# EAGLE design Wireless RIFID Reader (EAGLE 6.6.0)
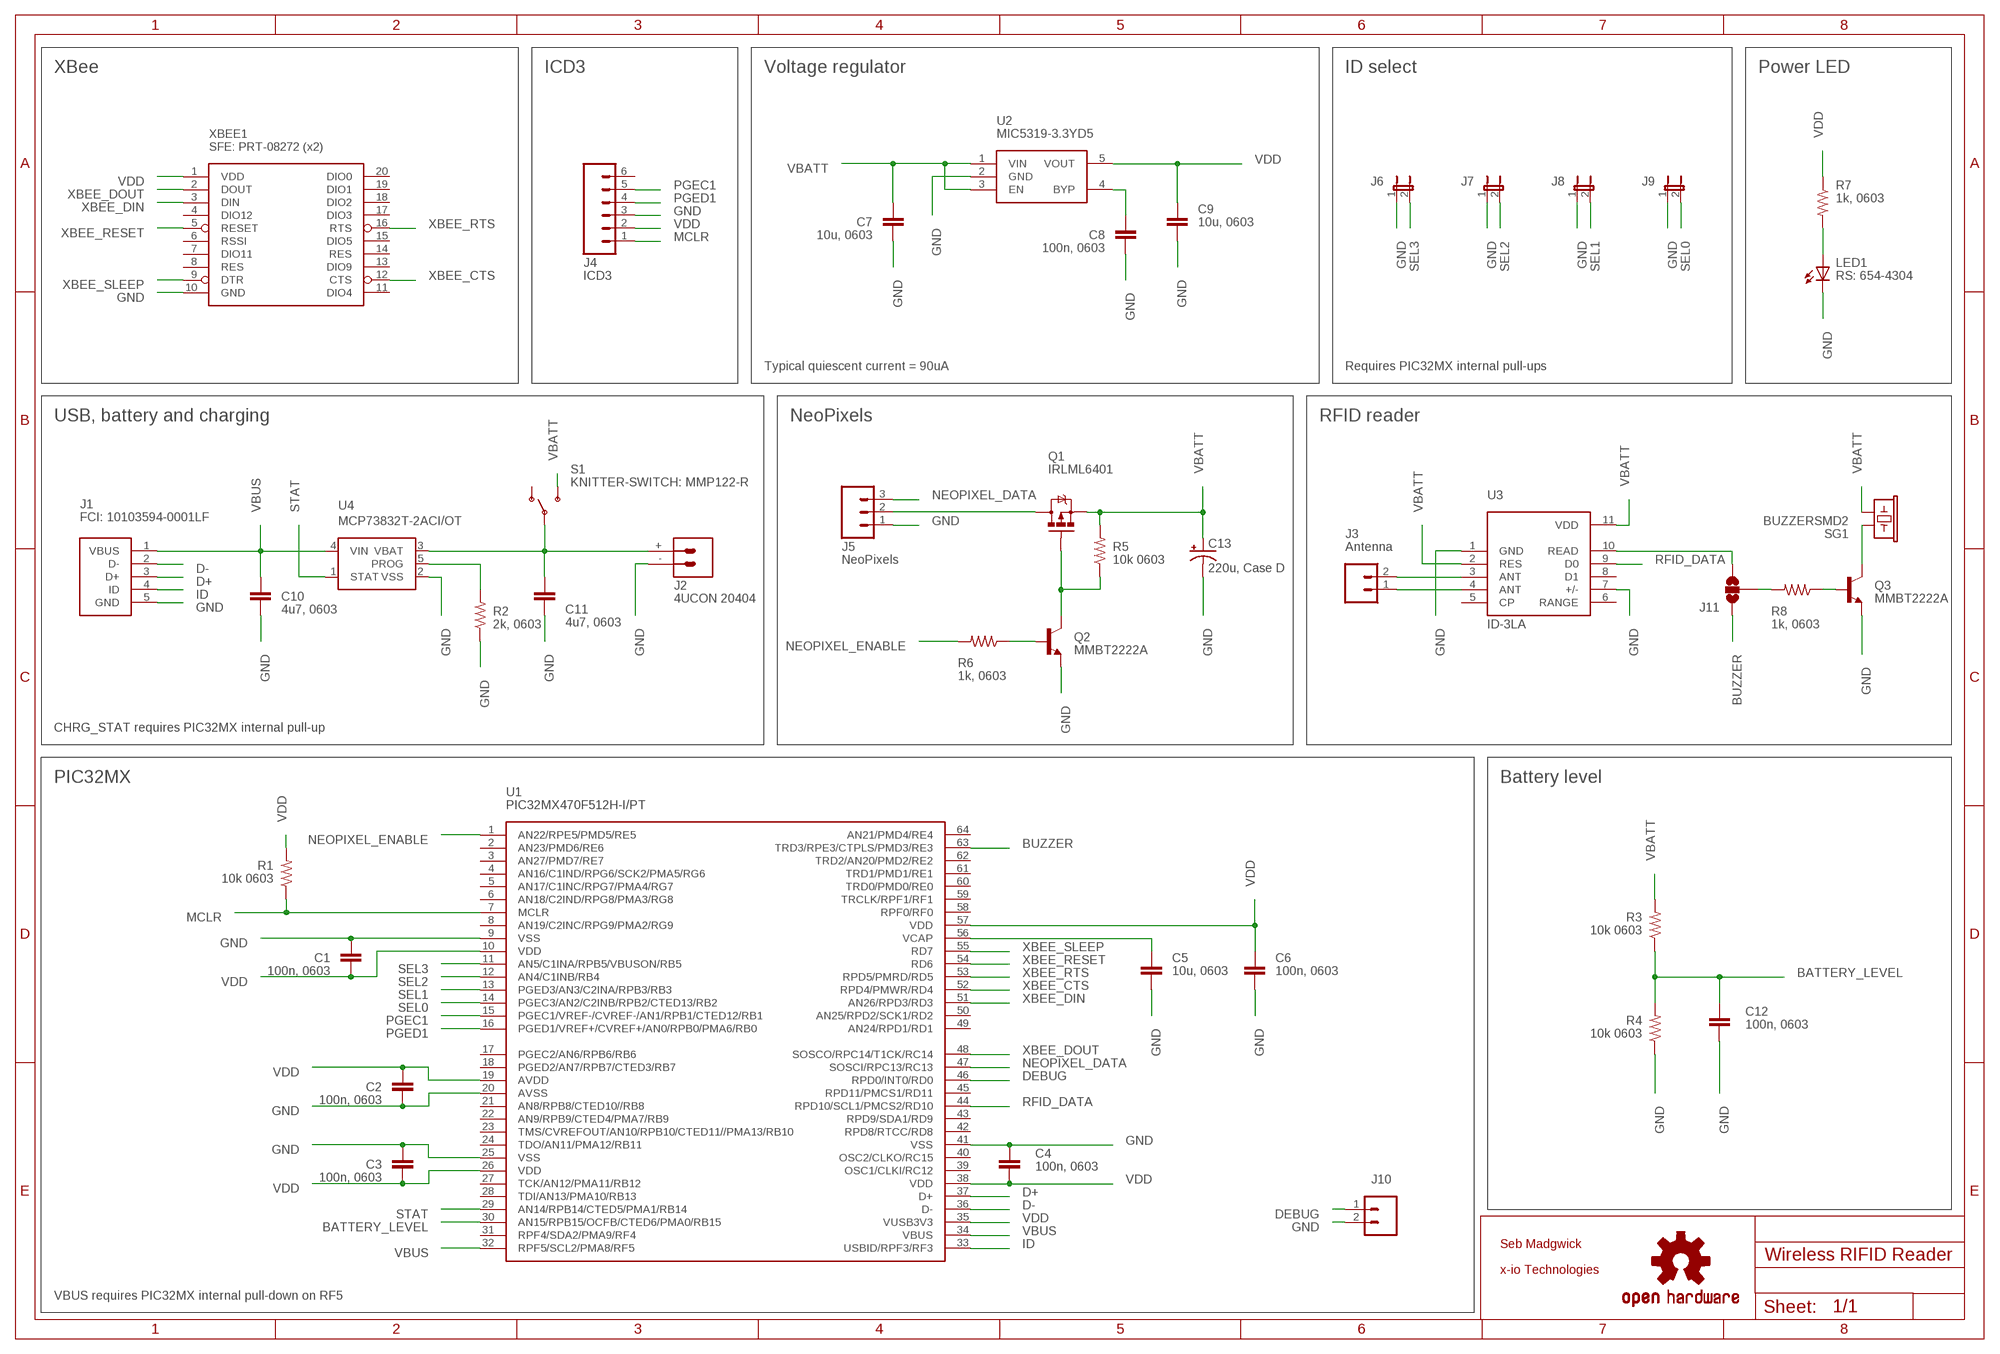
[diagram p0: schematic, sheet 1]

## Parts
C1  100n, 0603  CAP0402-CAP  [0402-CAP]
C2  100n, 0603  CAP0402-CAP  [0402-CAP]
C3  100n, 0603  CAP0402-CAP  [0402-CAP]
C4  100n, 0603  CAP0402-CAP  [0402-CAP]
C5  10u, 0603  CAP0402-CAP  [0402-CAP]
C6  100n, 0603  CAP0402-CAP  [0402-CAP]
C7  10u, 0603  CAP0402-CAP  [0402-CAP]
C8  100n, 0603  CAP0402-CAP  [0402-CAP]
C9  10u, 0603  CAP0402-CAP  [0402-CAP]
C10  4u7, 0603  CAP0402-CAP  [0402-CAP]
C11  4u7, 0603  CAP0402-CAP  [0402-CAP]
C12  100n, 0603  CAP0402-CAP  [0402-CAP]
C13  220u, Case D  CPOL-USSMCD  [SMC_D]
J1  FCI: 10103594-0001LF  USB-MICRO-B  [10103594-0001LF]
J2  4UCON 20404  JST  [JST-R/A]
J3  Antenna  M02PTH  [1X02]
J4  ICD3  M06NO_SILK  [1X06_NO_SILK]
J5  NeoPixels  M03PTH  [1X03]
J6  JUMPER-2SMD-NO  [SJ_2S-NO]
J7  JUMPER-2SMD-NO  [SJ_2S-NO]
J8  JUMPER-2SMD-NO  [SJ_2S-NO]
J9  JUMPER-2SMD-NO  [SJ_2S-NO]
J10  M02PTH  [1X02]
J11  JUMPER-PAD-3-NOFULL_BOX_SILK  [PAD-JUMPER-3-NO_YES_SILK_FULL_BOX]
LED1  RS: 654-4304  LED0603  [LED-0603]
LOGO1  OSHW-LOGOM  [OSHW-LOGO-M]
Q1  IRLML6401  MOSFET-PCHANNEL  [SOT23]
Q2  MMBT2222A  TRANSISTOR_NPNMMBT2222A  [SOT23-3]
Q3  MMBT2222A  TRANSISTOR_NPNMMBT2222A  [SOT23-3]
R1  10k 0603  RESISTOR0402-RES  [0402-RES]
R2  2k, 0603  RESISTOR0402-RES  [0402-RES]
R3  10k 0603  RESISTOR0402-RES  [0402-RES]
R4  10k 0603  RESISTOR0402-RES  [0402-RES]
R5  10k 0603  RESISTOR0402-RES  [0402-RES]
R6  1k, 0603  RESISTOR0402-RES  [0402-RES]
R7  1k, 0603  RESISTOR0402-RES  [0402-RES]
R8  1k, 0603  RESISTOR0402-RES  [0402-RES]
S1  KNITTER-SWITCH: MMP122-R  SWITCH-DPSTMMP122-R  [MMP122-R]
SG1  BUZZERSMD2  [BUZZER-CCV]
U1  PIC32MX470F512H-I/PT  [TQFP64-10X10]
U2  MIC5319-3.3YD5  MIC5319  [SOT23-5]
U3  ID-3LA  [ID-3LA]
U4  MCP73832T-2ACI/OT  MCP73831  [SOT23-5]
XBEE1  SFE: PRT-08272 (x2)  XBEE-1B1  [XBEE-1]

## Nets
BATTERY_LEVEL: C12.1 R3.1 R4.2 U1.30(AN15/RPB15/OCFB/CTED6/PMA0/RB15)
BUZZER: J11.1 U1.63(TRD3/RPE3/CTPLS/PMD3/RE3)
D+: J1.3(D+) U1.37(D+)
D-: J1.2(D-) U1.36(D-)
DEBUG: J10.1 U1.46(RPD0/INT0/RD0)
GND: C1.1 C2.2 C3.1 C4.1 C5.2 C6.2 C7.2 C8.2 C9.2 C10.2 C11.2 C12.2 C13.- J1.5(GND) J2.- J4.3 J5.1 J6.1 J7.1 J8.1 J9.1 J10.2 LED1.C Q2.2(E) Q3.2(E) R2.1 R4.1 U1.9(VSS) U1.20(AVSS) U1.25(VSS) U1.41(VSS) U2.2(GND) U3.1(GND) U3.7(+/-) U4.2(VSS) XBEE1.10(GND)
ID: J1.4(ID) U1.33(USBID/RPF3/RF3)
MCLR: J4.1 R1.1 U1.7(MCLR)
N$1: J3.2 U3.3(ANT)
N$2: J3.1 U3.4(ANT)
N$3: C11.1 J2.+ S1.2 U4.3(VBAT)
N$4: J5.2 Q1.3(D)
N$5: Q1.1(G) Q2.3(C) R5.1
N$6: Q2.1(B) R6.1
N$7: C8.1 U2.4(BYP)
N$8: R2.2 U4.5(PROG)
N$9: LED1.A R7.2
N$10: Q3.1(B) R8.1
N$11: C5.1 U1.56(VCAP)
N$12: Q3.3(C) SG1.+
N$13: J11.3 U3.10(READ)
N$15: J11.2 R8.2
NEOPIXEL_DATA: J5.3 U1.47(SOSCI/RPC13/RC13)
NEOPIXEL_ENABLE: R6.2 U1.1(AN22/RPE5/PMD5/RE5)
PGEC1: J4.5 U1.15(PGEC1/VREF-/CVREF-/AN1/RPB1/CTED12/RB1)
PGED1: J4.4 U1.16(PGED1/VREF+/CVREF+/AN0/RPB0/PMA6/RB0)
RFID_DATA: U1.44(RPD10/SCL1/PMCS2/RD10) U3.9(D0)
SEL0: J9.2 U1.14(PGEC3/AN2/C2INB/RPB2/CTED13/RB2)
SEL1: J8.2 U1.13(PGED3/AN3/C2INA/RPB3/RB3)
SEL2: J7.2 U1.12(AN4/C1INB/RB4)
SEL3: J6.2 U1.11(AN5/C1INA/RPB5/VBUSON/RB5)
STAT: U1.29(AN14/RPB14/CTED5/PMA1/RB14) U4.1(STAT)
VBATT: C7.1 C13.+ Q1.2(S) R3.2 R5.2 S1.3 SG1.- U2.1(VIN) U2.3(EN) U3.2(RES) U3.11(VDD)
VBUS: C10.1 J1.1(VBUS) U1.32(RPF5/SCL2/PMA8/RF5) U1.34(VBUS) U4.4(VIN)
VDD: C1.2 C2.1 C3.2 C4.2 C6.1 C9.1 J4.2 R1.2 R7.1 U1.10(VDD) U1.19(AVDD) U1.26(VDD) U1.35(VUSB3V3) U1.38(VDD) U1.57(VDD) U2.5(VOUT) XBEE1.1(VDD)
XBEE_CTS: U1.52(RPD4/PMWR/RD4) XBEE1.12(CTS)
XBEE_DIN: U1.51(AN26/RPD3/RD3) XBEE1.3(DIN)
XBEE_DOUT: U1.48(SOSCO/RPC14/T1CK/RC14) XBEE1.2(DOUT)
XBEE_RESET: U1.54(RD6) XBEE1.5(RESET)
XBEE_RTS: U1.53(RPD5/PMRD/RD5) XBEE1.16(RTS)
XBEE_SLEEP: U1.55(RD7) XBEE1.9(DTR)
Unconnected: J4.6 S1.1 U1.2(AN23/PMD6/RE6) U1.3(AN27/PMD7/RE7) U1.4(AN16/C1IND/RPG6/SCK2/PMA5/RG6) U1.5(AN17/C1INC/RPG7/PMA4/RG7) U1.6(AN18/C2IND/RPG8/PMA3/RG8) U1.8(AN19/C2INC/RPG9/PMA2/RG9) U1.17(PGEC2/AN6/RPB6/RB6) U1.18(PGED2/AN7/RPB7/CTED3/RB7) U1.21(AN8/RPB8/CTED10//RB8) U1.22(AN9/RPB9/CTED4/PMA7/RB9) U1.23(TMS/CVREFOUT/AN10/RPB10/CTED11//PMA13/RB10) U1.24(TDO/AN11/PMA12/RB11) U1.27(TCK/AN12/PMA11/RB12) U1.28(TDI/AN13/PMA10/RB13) U1.31(RPF4/SDA2/PMA9/RF4) U1.39(OSC1/CLKI/RC12) U1.40(OSC2/CLKO/RC15) U1.42(RPD8/RTCC/RD8) U1.43(RPD9/SDA1/RD9) U1.45(RPD11/PMCS1/RD11) U1.49(AN24/RPD1/RD1) U1.50(AN25/RPD2/SCK1/RD2) U1.58(RPF0/RF0) U1.59(TRCLK/RPF1/RF1) U1.60(TRD0/PMD0/RE0) U1.61(TRD1/PMD1/RE1) U1.62(TRD2/AN20/PMD2/RE2) U1.64(AN21/PMD4/RE4) U3.5(CP) U3.6(RANGE) U3.8(D1) XBEE1.4(DIO12) XBEE1.6(RSSI) XBEE1.7(DIO11) XBEE1.8(RES) XBEE1.11(DIO4) XBEE1.13(DIO9) XBEE1.14(RES) XBEE1.15(DIO5) XBEE1.17(DIO3) XBEE1.18(DIO2) XBEE1.19(DIO1) XBEE1.20(DIO0)

## Notes on the sheet
- XBee | ICD3 | Voltage regulator | ID select | Power LED
- Typical quiescent current = 90uA | Requires PIC32MX internal pull-ups
- USB, battery and charging | NeoPixels | RFID reader
- CHRG_STAT requires PIC32MX internal pull-up
- PIC32MX | Battery level
- Seb Madgwick
- x-io Technologies
- VBUS requires PIC32MX internal pull-down on RF5

## Library data of the parts
C1-C12 = SparkFun:CAP: Capacitor Standard 0603 ceramic capacitor, and 0.1" leaded capacitor.
C13 = rcl:CPOL-US: POLARIZED CAPACITOR, American symbol
J1 = x-io:USB-MICRO-B
J2 = x-io:JST
J3 = SparkFun-Connectors:M02: Standard 2-pin 0.1" header. Use with - straight break away headers ( PRT-00116) - right angle break away headers (PRT-00553) - swiss pins (PRT-00743) - machine pins (PRT-00117) - female headers (PRT-00115) Molex polarized connector foot print use with: PRT-08233 with associated crimp pins and housings. 2.54_SCREWTERM for use with PRT-10571. 3.5mm Screw Terminal footprints for PRT-08084 5mm Screw Terminal footprints for use with PRT-08433
J4 = SparkFun-Connectors:M06: Header 6 Standard 6-pin 0.1" header. Use with straight break away headers (SKU : PRT-00116), right angle break away headers (PRT-00553), swiss pins (PRT-00743), machine pins (PRT-00117), and female headers (PRT-00115). Molex polarized connector foot print use with SKU : PRT-08094 with associated crimp pins and housings. NOTES ON THE VARIANTS LOCK and LOCK_LONGPADS... This footprint was designed to help hold the alignment of a through-hole component (i.e. 6-pin header) while soldering it into place. You may notice that each hole has been shifted either up or down by 0.005 of an inch from it's more standard position (which is a perfectly straight line). This slight alteration caused the pins (the squares in the middle) to touch the edges of the holes. Because they are alternating, it causes a "brace" to hold the component in place. 0.005 has proven to be the perfect amount of "off-center" position when using our standard breakaway headers. Although looks a little odd when you look at the bare footprint, once you have a header in there, the alteration is very hard to notice. Also,if you push a header all the way into place, it is covered up entirely on the bottom side. This idea of altering the position of holes to aid alignment will be further integrated into the Sparkfun Library for other footprints. It can help hold any component with 3 or more connection pins.
J5 = SparkFun-Connectors:M03: Header 3 Standard 3-pin 0.1" header. Use with straight break away headers (SKU : PRT-00116), right angle break away headers (PRT-00553), swiss pins (PRT-00743), machine pins (PRT-00117), and female headers (PRT-00115). Molex polarized connector foot print use with SKU : PRT-08232 with associated crimp pins and housings.
J6-J9 = SparkFun:JUMPER-2: Jumper Basic 0.1" spaced jumper. Use with breakaway headers.
J10 = SparkFun:M02: Header 2 Standard 2-pin 0.1" header. Use with straight break away headers (SKU : PRT-00116), right angle break away headers (PRT-00553), swiss pins (PRT-00743), machine pins (PRT-00117), and female headers (PRT-00115). Molex polarized connector foot print use with SKU : PRT-08233 with associated crimp pins and housings.
J11 = SparkFun-Passives:JUMPER-PAD-3-NO
LED1 = SparkFun:LED: LEDs Standard schematic elements and footprints for 5mm, 3mm, 1206, and 0603 sized LEDs. 5mm - Spark Fun Electronics SKU : COM-00529 (and others)
LOGO1 = SparkFun-Aesthetics:OSHW-LOGO: Open Source Hardware Logo This logo indicates the piece of hardware it is found on incorporates a OSHW license and/or adheres to the definition of open source hardware found here: http://freedomdefined.org/OSHW
Q1 = SparkFun:MOSFET-PCHANNEL
Q2 Q3 = SparkFun-DiscreteSemi:TRANSISTOR_NPN: Generic NPN BJT MMBT2222A - TRANS-08049 (SOT-23, 1A 40V) MPSA42 - TRANS-09116 (SOT-23, 500mA 300V) MMBT5088LT1G - TRANS-11160 (SOT-23, 50 mA 30V) BC547 - COM-08928 <http://www.sparkfun.com/products/8928> (TO-92 45V 100mA) (1.Collector 2.Base 3.Emitter) 2N3904 - COM-00521 <http://www.sparkfun.com/products/521> (TO-92 40V 200mA) (1.Emitter 2.Base 3.Collector) P2N2222A - COM-12852 <http://www.sparkfun.com/products/12852> (TO-92 40V 600mA) (1.Collector 2.Base 3.Emitter); PROD_ID: TRANS-08049
R1-R8 = SparkFun:RESISTOR: Resistor Basic schematic elements and footprints for 0603, 1206, and PTH 1/10th watt (small) resistors.
S1 = x-io:SWITCH-DPST: SPST Switch Simple slide switch. Spark Fun Electronics SKU : COM-00102
SG1 = SparkFun-Electromechanical:BUZZER: Buzzer 12mm Spark Fun Electronics SKU : Comp-Buzzer
U1 = x-io:PIC32MX470F512H
U2 = x-io:MIC5319
U3 = x-io:ID-3LA
U4 = SparkFun:MCP73831: Microchip's MCP73831 Miniature single cell, fully integrated Li-Ion, Li-polymer charge management controller http://ww1.microchip.com/downloads/en/DeviceDoc/21984a.pdf
XBEE1 = SparkFun:XBEE-1

## Board
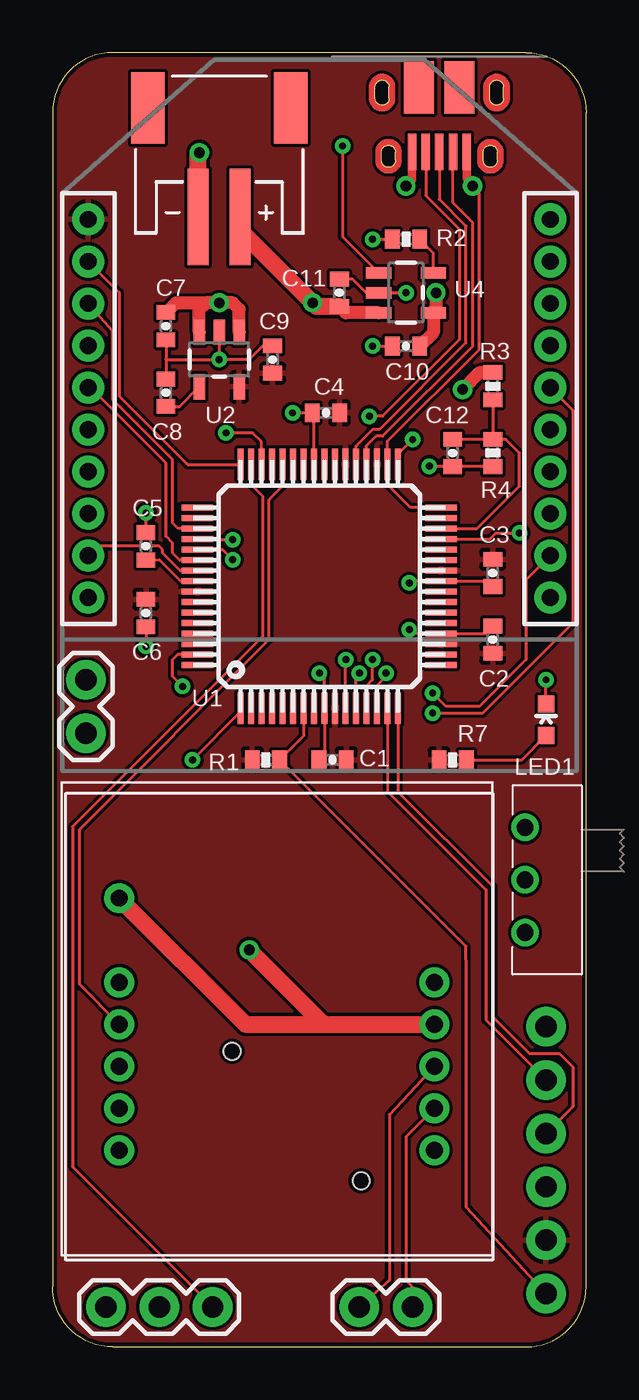
[diagram p1: board, top side]
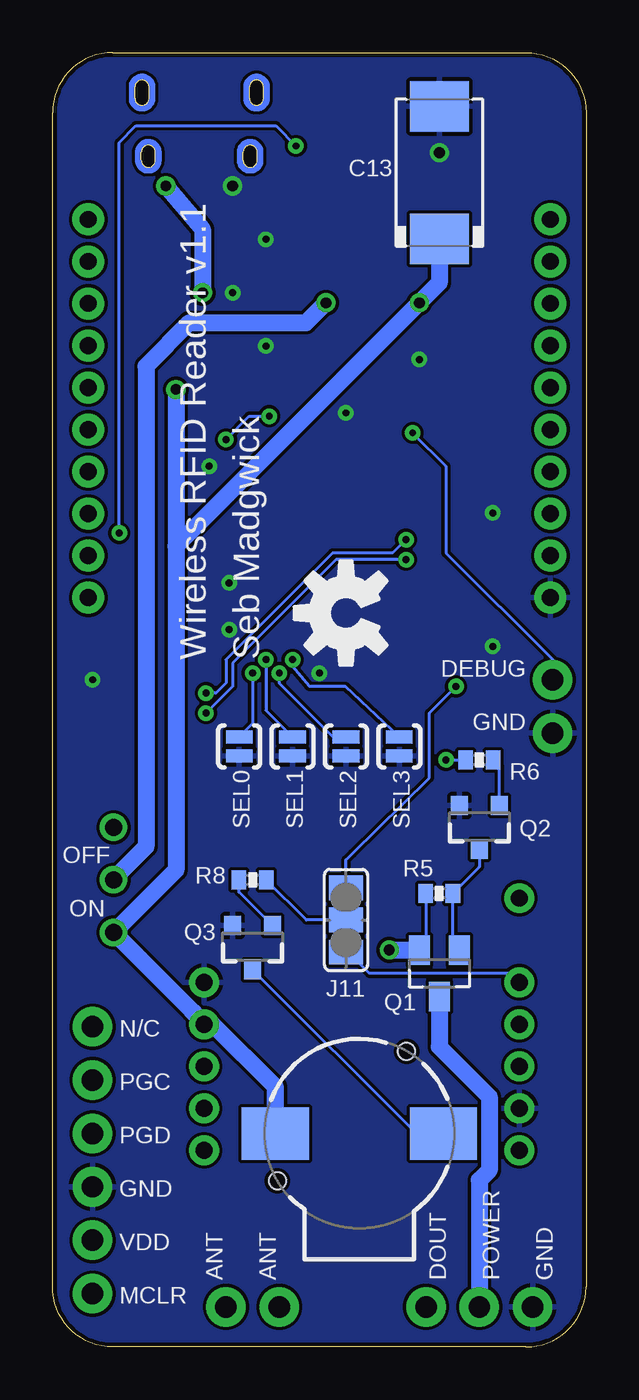
[diagram p2: board, bottom side, seen from below]

Size 25.4 x 61.59 mm. Coordinates in mm from the lower left corner, seen from the top.
Outline: 2.86,0 22.54,0 arc90 25.4,2.86 25.4,58.74 arc90 22.54,61.59 2.86,61.59 arc90 0,58.74 0,2.86 arc90 2.86,0
Copper layers (1*16): Top 0.035mm / dielectric 1.5mm / Bottom 0.035mm
Design rules "default *": minimum track width 6mil, minimum drill 13mil, track to track 6mil, track to pad 6mil, pad to pad 6mil, via to via 6mil, smd to smd 0.15mm, copper to edge 0.2mm, drill to drill 0.15mm, minimum pad ring 10mil, minimum via ring 8mil, stop-mask expansion 4mil, vias tented up to drill 1mm, thermal gap 0.195mm

### Footprints (pad centres in the part's own frame; a part is rotated, then mirrored left to right if it is on the bottom)
0402-CAP = smd 0.7 x 0.9: 1 -0.65,0; 2 0.65,0
SMC_D = smd 2.4 x 2.8: + -3.15,0; - 3.15,0
10103594-0001LF = smd 0.4 x 1.75: 1 -1.3,2.825; 2 -0.65,2.825; 3 0,2.825; 4 0.65,2.825; 5 1.3,2.825 | smd 1.425 x 2.5: P$1 0.963,-0.25; P$2 -0.963,-0.25
JST-R/A = smd 1 x 4.6: + 1,-3.7; - -1,-3.7 | smd 1.6 x 3.4: NC1 -3.4,1.5; NC2 3.4,1.5
1X02 = drill 1.016 pad 1.88: 1 0,0; 2 2.54,0
1X06_NO_SILK = drill 1.016 pad 1.88: 1 0,0; 2 2.54,0; 3 5.08,0; 4 7.62,0; 5 10.16,0; 6 12.7,0
1X03 = drill 1.016 pad 1.88: 1 0,0; 2 2.54,0; 3 5.08,0
SJ_2S-NO = smd 0.635 x 1.27: 1 -0.45,0; 2 0.45,0
PAD-JUMPER-3-NO_YES_SILK_FULL_BOX = smd 1.168 x 1.6: 1 -1.524,0; 2 0,0; 3 1.524,0
LED-0603 = smd 0.8 x 0.8: A 0,-0.75; C 0,0.75
SOT23 = smd 1 x 1.4: 1 -0.95,-1.1; 2 0.95,-1.1; 3 0,1.1
SOT23-3 = smd 0.8 x 0.9: 1 -0.95,-1; 2 0.95,-1; 3 0,1.1
0402-RES = smd 0.7 x 0.9: 1 -0.65,0; 2 0.65,0
MMP122-R = drill 0.8: 1 -2.5,-1; 2 0,-1; 3 2.5,-1
BUZZER-CCV = smd 3.2 x 2.5: + 4,0; - -4,0 | hole 0.8: -3.9,-2.25; 2.25,3.9
TQFP64-10X10 = smd 1.5 x 0.28: 1 -5.8,3.75; 2 -5.8,3.25; 3 -5.8,2.75; 4 -5.8,2.25; 5 -5.8,1.75; 6 -5.8,1.25; 7 -5.8,0.75; 8 -5.8,0.25; 9 -5.8,-0.25; 10 -5.8,-0.75; 11 -5.8,-1.25; 12 -5.8,-1.75; 13 -5.8,-2.25; 14 -5.8,-2.75; 15 -5.8,-3.25; 16 -5.8,-3.75; 33 5.8,-3.75; 34 5.8,-3.25; 35 5.8,-2.75; 36 5.8,-2.25; 37 5.8,-1.75; 38 5.8,-1.25; 39 5.8,-0.75; 40 5.8,-0.25; 41 5.8,0.25; 42 5.8,0.75; 43 5.8,1.25; 44 5.8,1.75; 45 5.8,2.25; 46 5.8,2.75; 47 5.8,3.25; 48 5.8,3.75 | smd 0.28 x 1.5: 17 -3.75,-5.8; 18 -3.25,-5.8; 19 -2.75,-5.8; 20 -2.25,-5.8; 21 -1.75,-5.8; 22 -1.25,-5.8; 23 -0.75,-5.8; 24 -0.25,-5.8; 25 0.25,-5.8; 26 0.75,-5.8; 27 1.25,-5.8; 28 1.75,-5.8; 29 2.25,-5.8; 30 2.75,-5.8; 31 3.25,-5.8; 32 3.75,-5.8; 49 3.75,5.8; 50 3.25,5.8; 51 2.75,5.8; 52 2.25,5.8; 53 1.75,5.8; 54 1.25,5.8; 55 0.75,5.8; 56 0.25,5.8; 57 -0.25,5.8; 58 -0.75,5.8; 59 -1.25,5.8; 60 -1.75,5.8; 61 -2.25,5.8; 62 -2.75,5.8; 63 -3.25,5.8; 64 -3.75,5.8
SOT23-5 = smd 0.55 x 1.2: 1 -0.95,-1.3; 2 0,-1.3; 3 0.95,-1.3; 4 0.95,1.3; 5 -0.95,1.3
ID-3LA = drill 0.8 pad 1.422: 1 2.75,-6.75; 2 0.75,-6.75; 3 -1.25,-6.75; 4 -3.25,-6.75; 5 -5.25,-6.75; 6 -5.25,8.25; 7 -3.25,8.25; 8 -1.25,8.25; 9 0.75,8.25; 10 2.75,8.25; 11 6.75,8.25
XBEE-1 = drill 0.8 pad 1.524: 1 -11,20; 2 -11,18; 3 -11,16; 4 -11,14; 5 -11,12; 6 -11,10; 7 -11,8; 8 -11,6; 9 -11,4; 10 -11,2; 11 11,2; 12 11,4; 13 11,6; 14 11,8; 15 11,10; 16 11,12; 17 11,14; 18 11,16; 19 11,18; 20 11,20

### Placement (x,y rotation side)
C1  13.34,27.94 0 top
C2  20.95,33.66 90 top
C3  20.95,36.83 90 top
C4  13.02,44.45 0 top
C5  4.45,38.1 90 top
C6  4.45,34.92 270 top
C7  5.4,48.58 270 top
C8  5.4,45.4 90 top
C9  10.48,46.99 90 top
C10  16.83,47.62 180 top
C11  13.65,50.16 90 top
C12  19.05,42.55 270 top
C13  6.99,55.88 90 bottom
J1  18.41,59.69 180 top
J2  7.94,57.47 0 top
J3  17.14,1.91 180 top
J4  23.5,2.54 90 top
J5  2.54,1.91 0 top
J6  8.89,28.57 90 bottom
J7  11.43,28.57 90 bottom
J8  13.97,28.57 90 bottom
J9  16.51,28.57 90 bottom
J10  1.59,31.75 270 top
J11  11.43,20.32 270 bottom
LED1  23.5,29.84 0 top
LOGO1  11.43,34.92 90 bottom
Q1  6.99,17.78 180 bottom
Q2  5.08,24.77 180 bottom
Q3  15.88,19.05 180 bottom
R1  10.16,27.94 180 top
R2  16.83,52.7 0 top
R3  20.95,45.72 90 top
R4  20.95,42.55 90 top
R5  6.99,21.59 180 bottom
R6  5.08,27.94 180 bottom
R7  19.05,27.94 0 top
R8  15.88,22.23 0 bottom
S1  23.5,22.23 270 top
SG1  10.79,10.16 0 bottom
U1  12.7,36.2 90 top
U2  7.94,46.99 180 top
U3  11.43,14.61 90 top
U4  16.83,50.16 270 top
XBEE1  12.7,33.66 0 top

### Tracks (layer width: path | path; a pad name or v marks a point on that pad's centre or on a via)
BATTERY_LEVEL
  Top 0.152: C12.1 R4.2 | R3.1 R4.2 | U1.30 20.21,38.95 22.23,40.96 22.23,42.55 21.59,43.18 20.97,43.18 R4.2
BUZZER  (via drill 0.33)
  Top 0.152: U1.63 5.96,32.95 5.71,32.7 5.71,31.91 v6.19,31.43
  Bottom 0.152: J11.1 11.43,23.18 11.11,23.5 7.46,27.08 7.46,30.16 v6.19,31.43
D+
  Top 0.152: U1.37 14.45,42.87 15.24,43.66 15.56,43.66 19.68,47.78 19.68,53.34 18.41,54.61 J1.3
D-
  Top 0.152: U1.36 14.95,42.89 15.4,43.34 15.72,43.34 20,47.62 20,53.5 19.05,54.45 J1.2
DEBUG  (via drill 0.33)
  Top 0.152: U1.46 9.95,43.07 9.53,43.5 v8.26,43.5
  Bottom 0.152: v8.26,43.5 6.67,41.91 6.67,37.78 1.59,32.7 J10.1
GND  (via drill 0.33, 0.51)
  Top 0.152: U2.2 v7.94,46.99 | 5.4,46.99 C8.2 | C7.2 5.4,46.99 | 5.4,46.99 v7.94,46.99 | C9.2 10.02,47.64 9.37,46.99 v7.94,46.99 | v16.83,50.16 U4.2 14.92,50.16 14.29,50.8 13.67,50.8 C11.2 | v15.24,52.7 R2.1 | v15.24,47.62 C10.2 | U1.41 12.45,44.37 C4.1 v11.43,44.45 | R4.1 C12.2 19.04,41.91 v17.94,41.91 | v12.7,32.07 12.95,31.82 U1.9 12.95,28.2 C1.1 | C5.2 v4.45,39.69 | C6.2 v4.45,33.34 | C2.2 20.59,33.95 U1.20 17.17,33.95 v16.99,34.13 | C3.1 20.69,36.45 U1.25 17.08,36.45 v16.99,36.35 | LED1.C v23.5,31.75
  Top 0.406: J1.5 17.11,55.53 v16.83,55.24
  Top 0.813: J2.- 6.94,56.78 v6.99,56.83
  pour Bottom: 0,61.59 25.4,61.59 25.4,0 0,0
ID  (via drill 0.33)
  Top 0.152: v15.08,44.29 15.72,44.29 19.37,47.94 19.37,53.18 17.77,54.78 J1.4 | U1.33 16.45,42.48 v17.14,43.18
  Bottom 0.152: v17.14,43.18 16.03,44.29 v15.08,44.29
MCLR
  Top 0.152: U1.7 11.95,29.08 R1.1 19.68,19.07 19.68,18.41 19.68,6.67 J4.1
N$1
  Top 0.152: U3.3 16.03,11.05 16.03,3.17 J3.2
N$2
  Top 0.152: U3.4 16.83,10 16.83,3.17 17.14,2.86 J3.1
N$3  (via drill 0.51)
  Top 0.61: 8.89,53.18 8.89,53.72 J2.+ | U4.3 13.95,49.22 C11.1
  Top 0.813: C11.1 12.56,49.52 v12.38,49.69 8.89,53.18
  Bottom 0.813: v12.38,49.69 13.34,48.74 18.89,48.74 20.95,46.67 20.95,23.81 22.5,22.27 S1.2
N$4
  Bottom 0.813: Q1.3 6.99,14.29 4.6,11.91 4.6,8.41 5.08,7.94 J5.2
N$5
  Bottom 0.152: Q1.1 6.33,19.18 R5.1 5.08,22.84 Q2.3
N$6
  Bottom 0.152: Q2.1 4.13,27.64 R6.1
N$7
  Top 0.152: C8.1 6.05,44.75 U2.4
N$8
  Top 0.152: U4.5 18.13,52.05 R2.2
N$9
  Top 0.152: R7.2 22.34,27.94 LED1.A
N$10
  Bottom 0.152: Q3.1 16.52,21.65 R8.1
N$11
  Top 0.152: U1.56 6.1,36.45 5.08,37.47 4.78,37.45 C5.1
N$12
  Bottom 0.152: SG1.+ 8.09,10.16 Q3.3
N$13
  Bottom 0.152: U3.10 3.6,17.78 10.32,17.78 11.34,18.8 J11.3
N$15
  Bottom 0.152: J11.2 13.32,20.32 R8.2
NEOPIXEL_DATA
  Top 0.152: U1.47 9.45,41.03 10,40.48 10,33.81 0.95,24.77 0.95,8.57 J5.3
NEOPIXEL_ENABLE  (via drill 0.33)
  Top 0.152: U1.1 8.96,30.24 v6.67,27.94
  Bottom 0.152: v6.67,27.94 R6.2
PGEC1
  Top 0.152: U1.15 15.95,27.86 15.95,26.44 20.64,21.75 20.64,15.56 J4.5
PGED1
  Top 0.152: J4.4 24.77,11.43 24.77,13.34 24.13,13.97 22.7,13.97 20.95,15.72 20.95,21.91 16.45,26.41 U1.16
RFID_DATA
  Top 0.152: 3.29,15.36 U3.9 1.27,17.27 1.27,24.61 10.32,33.66 10.32,40.32 10.95,40.95 U1.44
SEL0  (via drill 0.33)
  Top 0.152: v15.88,32.07 15.88,31.91 15.45,31.48 U1.14
  Bottom 0.152: v15.88,32.07 15.88,29.66 J9.2
SEL1  (via drill 0.33)
  Top 0.152: U1.13 14.95,31.46 15.24,31.75 v15.24,32.7
  Bottom 0.152: v15.24,32.7 15.24,30.3 J8.2
SEL2  (via drill 0.33)
  Top 0.152: U1.12 14.45,31.91 v14.61,32.07
  Bottom 0.152: v14.61,32.07 14.61,31.59 12.06,29.05 11.59,29.05 11.56,29.02 J7.2
SEL3  (via drill 0.33)
  Top 0.152: U1.11 13.95,32.68 v13.97,32.7
  Bottom 0.152: J6.2 11.46,31.43 13.18,31.43 13.97,32.38 v13.97,32.7
STAT  (via drill 0.33)
  Top 0.152: U1.29 20.82,38.45 21.11,38.73 v22.23,38.73 | v13.81,57.15 13.81,52.83 U4.1
  Bottom 0.152: v22.23,38.73 22.23,57.31 21.43,58.1 14.76,58.1 v13.81,57.15
VBATT  (via drill 0.51)
  Top 0.61: U2.3 6.99,49.37 7.3,49.69 | U2.1 8.89,49.37 8.57,49.69 v7.94,49.69 7.3,49.69 | C7.1 5.41,49.22 5.88,49.69 7.3,49.69 | R3.2 20.97,46.35 20.32,46.35 v19.53,45.56
  Top 0.813: U3.11 9.18,15.36 12.9,15.36 | U3.2 13.02,15.36 12.9,15.36 | v9.37,18.89 12.9,15.36
  Bottom 0.152: R5.2 7.63,19.18 Q1.2
  Bottom 0.813: v19.53,45.56 19.53,38.1 | 19.53,38.1 19.53,22.69 S1.3 18.76,15.99 U3.2 17.78,15.36 14.79,12.37 SG1.- | 19.53,38.1 v7.94,49.69 6.99,50.64 C13.+ | Q1.2 9.36,18.88 v9.37,18.89
VBUS  (via drill 0.51)
  Top 0.152: U1.32 17.05,39.95 15.95,41.04 U1.34 15.95,43.1 20.32,47.47 20.32,54.93 v20,55.24 | J1.1 19.68,56.87
  Top 0.406: J1.1 19.71,55.59 v20,55.24
  Top 0.61: v18.26,50.16 18.26,49.5 U4.4 18.13,48.27 C10.1
  Bottom 0.813: v20,55.24 18.26,53.18 v18.26,50.16
VDD
  pour Top: 0.01,61.56 25.4,61.59 25.4,0 0,0
XBEE_CTS  (via drill 0.33)
  Top 0.152: XBEE1.12 22.54,36.5 22.54,32.7 20.32,30.48 18.73,30.48 v18.1,31.11 | U1.52 6.93,38.42 v8.57,38.42
  Bottom 0.152: v8.57,38.42 9.21,37.78 12.06,37.78 17.14,32.7 17.14,31.59 17.62,31.11 v18.1,31.11
XBEE_DIN
  Top 0.152: XBEE1.3 2.86,48.34 2.86,45.09 5.71,42.23 5.71,39.21 5.98,38.95 U1.51
XBEE_DOUT
  Top 0.152: XBEE1.2 3.17,50.18 3.17,45.24 6.42,41.99 U1.48
XBEE_RESET
  Top 0.152: XBEE1.5 1.81,45.66 5.4,42.07 5.4,38.58 5.71,38.26 5.71,37.78 6.05,37.45 U1.54
XBEE_RTS  (via drill 0.33)
  Top 0.152: XBEE1.16 24.77,44.59 24.77,34.45 20.48,30.16 v18.1,30.16 | U1.53 8.09,37.95 v8.57,37.47
  Bottom 0.152: v8.57,37.47 11.91,37.47 16.83,32.54 16.83,31.43 v18.1,30.16
XBEE_SLEEP
  Top 0.152: U1.55 6.08,36.95 5.24,37.78 5.24,37.94 5.08,38.1 2.15,38.1 XBEE1.9

### Text on the board
_bsilk: DEBUG | Seb Madgwick | Wireless RFID Reader v1.1 | GND | SEL3 | SEL2 | SEL1 | SEL0 | OFF | ON | N/C | PGC | PGD | GND | VDD | GND | POWER | DOUT | ANT | ANT | MCLR